# Altium schematic sheet FPGA_SineWave.SchDoc: LiveDesign Evaluation - Sine Wave
size A4; Organization: Altium Limited; Address1: L3, 12a Rodborough Rd; Address2: Frenchs Forest; Address3: NSW; Address4: Australia 2086; DocumentNumber: 1; SheetNumber: 1; SheetTotal: 1
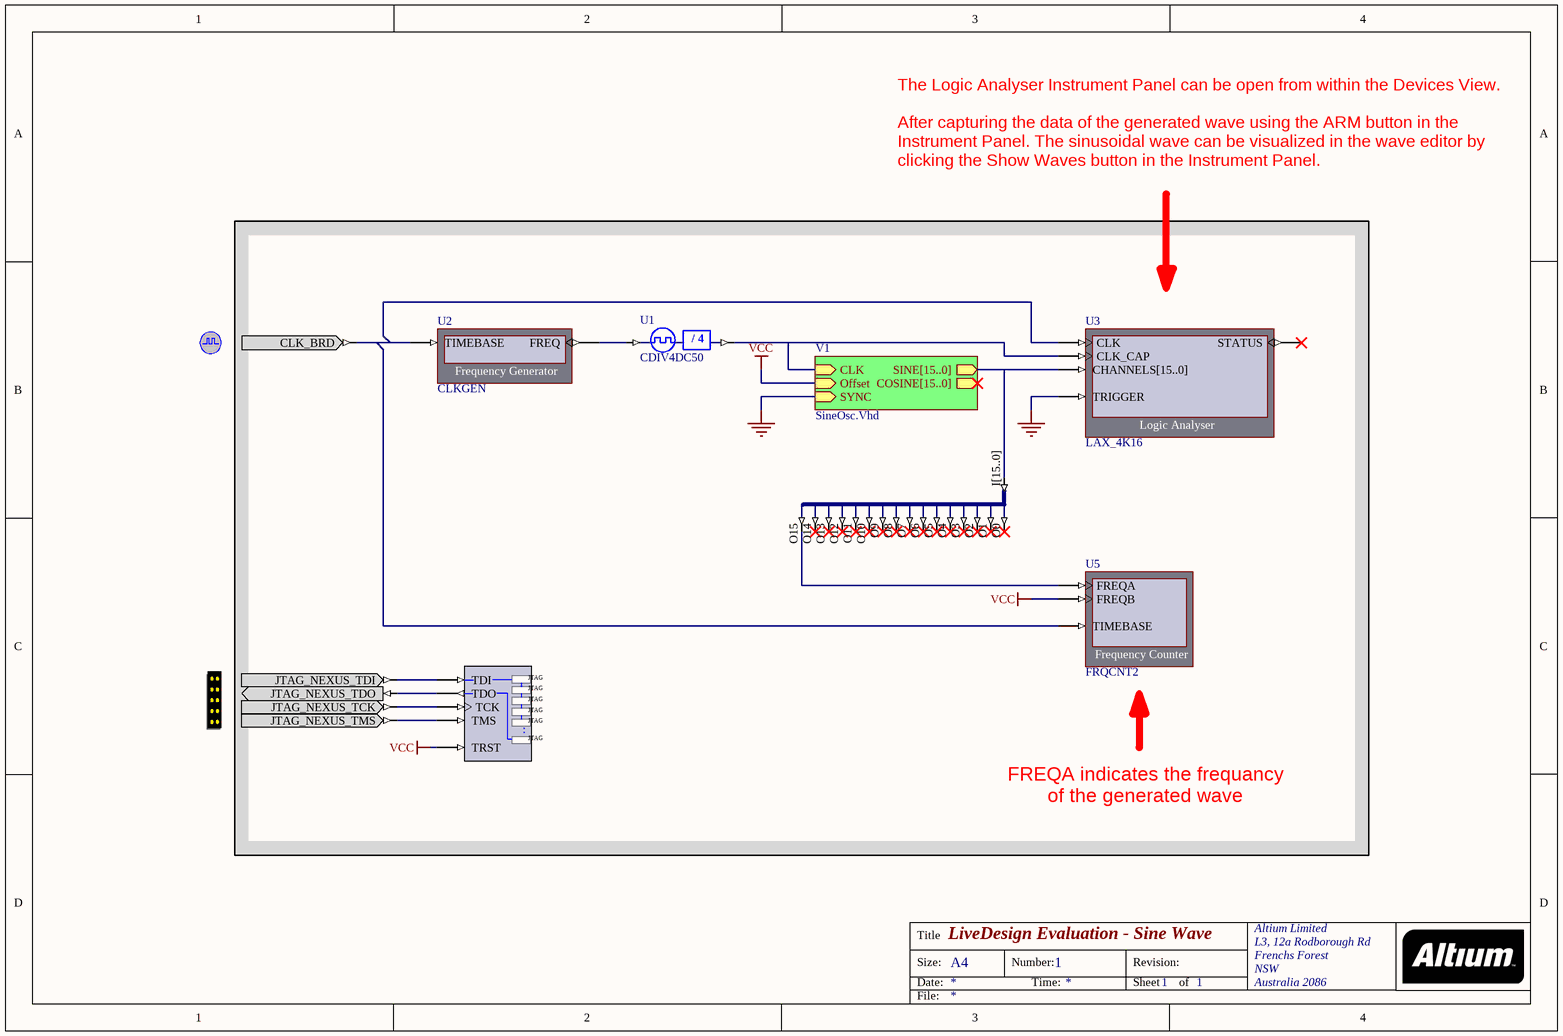
[diagram p0: FPGA_SineWave.SchDoc]

## Parts
CLOCK_BOARD  CLOCK_BOARD  (value not drawn)
NEXUS_JTAG_CONNECTOR  NEXUS_JTAG_CONNECTOR  (value not drawn)
NEXUS_JTAG_PORT  NEXUS_JTAG_PORT  (value not drawn)
U1  CDIV4DC50
U2  CLKGEN
U3  LAX_4K16
U4  J16B_16S  (value not drawn)
U5  FRQCNT2

## Sub-sheets
V1 = SineOsc.Vhd: CLK (in), SINE[15..0] (out), COSINE[15..0] (out), SYNC (in), Offset (in)

## Nets
GND: U3.TRIGGER ; sheet V1/SYNC
VCC: NEXUS_JTAG_PORT.TRST U5.FREQB ; sheet V1/Offset
NetCLOCK_BOARD_CLK_BRD: CLOCK_BOARD.CLK_BRD U2.TIMEBASE U3.CLK U5.TIMEBASE
NetNEXUS_JTAG_CONNECTOR_JTAG_NEXUS_TCK: NEXUS_JTAG_CONNECTOR.JTAG_NEXUS_TCK NEXUS_JTAG_PORT.TCK
NetNEXUS_JTAG_CONNECTOR_JTAG_NEXUS_TDI: NEXUS_JTAG_CONNECTOR.JTAG_NEXUS_TDI NEXUS_JTAG_PORT.TDI
NetNEXUS_JTAG_CONNECTOR_JTAG_NEXUS_TDO: NEXUS_JTAG_CONNECTOR.JTAG_NEXUS_TDO NEXUS_JTAG_PORT.TDO
NetNEXUS_JTAG_CONNECTOR_JTAG_NEXUS_TMS: NEXUS_JTAG_CONNECTOR.JTAG_NEXUS_TMS NEXUS_JTAG_PORT.TMS
NetU1_CLKDV: U1.CLKDV U3.CLK_CAP ; sheet V1/CLK
NetU1_CLKIN: U1.CLKIN U2.FREQ
NetU3_CHANNELS[15..0]: U3.CHANNELS[15..0] U4.I[15..0] ; sheet V1/SINE[15..0]
NetU4_O15: U4.O15 U5.FREQA

Not connected (* = marked no-connect by the designer): U3 STATUS*; U4 O0* O1* O2* O3* O4* O5* O6* O7* O8* O9* O10* O11* O12* O13* O14*

## Notes on the sheet
- The Logic Analyser Instrument Panel can be open from within the Devices View.
  After capturing the data of the generated wave using the ARM button in the Instrument Panel. The sinusoidal wave can be visualized in the wave editor by clicking the Show Waves button in the Instrument Panel.
- FREQA indicates the frequancy of the generated wave
- Title
- Size:
- Date:
- A4
- Number:
- Time:
- Revision:
- Sheet
- of
- File:
- (in symbol CDIV4DC50) / 4
- (in symbol LAX_4K16) Logic Analyser
- (in symbol NEXUS_JTAG_PORT) JTAG; .

## Library data of the parts
CLOCK_BOARD = CLOCK_BOARD: Global System Clock Supply; PortComponent: True; Published: 19-Nov-2003; Publisher: Altium Limited
NEXUS_JTAG_CONNECTOR = NEXUS_JTAG_CONNECTOR: JTAG Port; PortComponent: True; Published: 19-Nov-2003; Publisher: Altium Limited
NEXUS_JTAG_PORT = NEXUS_JTAG_PORT: Soft Nexus-Chain Connector; NEXUS_JTAG_CONNECTOR: True; Published: 18-Dec-2003; Publisher: Altium Limited
U1 = CDIV4DC50: Clock Divider by 4 with 50% Duty Cycle Output; ArchiveName: GENERIC; VHDLIB_SIM: GENERIC_LIB; Xilinx Equivalent: CLK_DIV4; Published: 29-Jan-2004; Publisher: Altium Limited; Core Revision: 1.00.00
U2 = CLKGEN: Frequency Generator; NEXUS_CORE: Instrument; NEXUS_JTAG_DEVICE: True; NEXUS_JTAG_ORDER: 0; Published: 18/12/2003; Publisher: Altium Hobart Technology Centre; Core Revision: 1.00.00
U3 = LAX_4K16: Logic Analyser 4K16; NEXUS_CORE: Instrument; NEXUS_JTAG_DEVICE: True; NEXUS_JTAG_ORDER: 0; ChildModel1: RAM4kx16_LA16_4K; Published: 18/12/2003; Publisher: Altium Hobart Technology Centre; Core Revision: 1.00.00
U4 = J16B_16S: Single 16-Bit input bus to 16 single pin outputs; ArchiveName: GENERIC; VHDLIB_SIM: GENERIC_LIB; Published: 29-Jan-2004; Publisher: Altium Limited; Core Revision: 1.00.00
U5 = FRQCNT2: Frequency Counter; NEXUS_CORE: Instrument; NEXUS_JTAG_DEVICE: True; NEXUS_JTAG_ORDER: 0; Published: 18/12/2003; Publisher: Altium Hobart Technology Centre; Core Revision: 1.00.00